# EAGLE design FT231X Breakout (EAGLE 6.4)
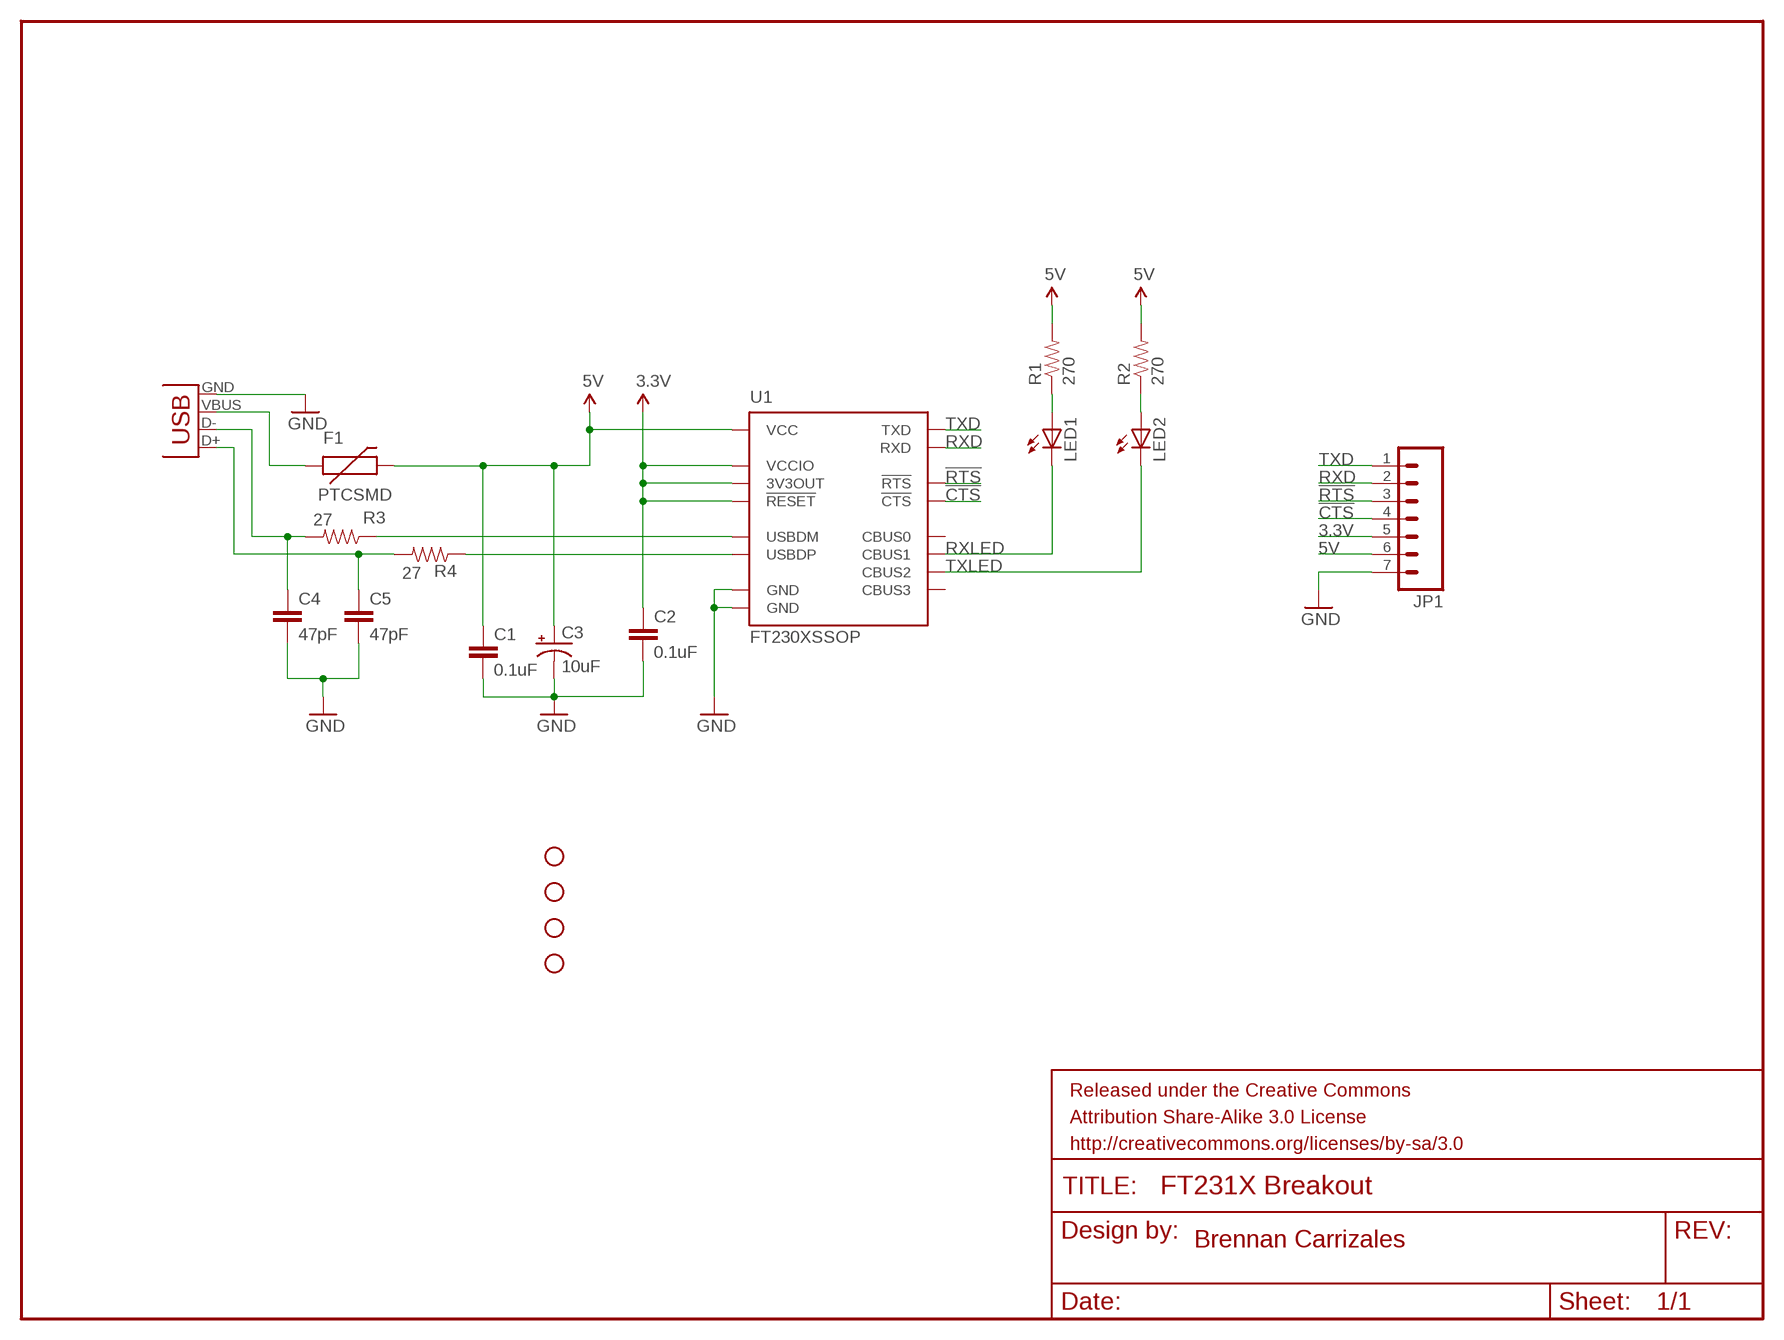
[diagram p0: schematic, sheet 1]

## Parts
C1  0.1uF  CAP0603-CAP  [0603-CAP]
C2  0.1uF  CAP0603-CAP  [0603-CAP]
C3  10uF  CAP_POL1206-KIT  [EIA3216-KIT]
C4  47pF  CAP0603-CAP  [0603-CAP]
C5  47pF  CAP0603-CAP  [0603-CAP]
F1  PTCSMD  [PTC-1206]
FRAME1  FRAME-LETTER  [CREATIVE_COMMONS]
JP1  M07  [1X07]
JP2  USBSMD  [USB-MINIB]
LED1  LED0603  [LED-0603]
LED2  LED0603  [LED-0603]
R1  270  RESISTOR0603-RES  [0603-RES]
R2  270  RESISTOR0603-RES  [0603-RES]
R3  27  RESISTOR0603-RES  [0603-RES]
R4  27  RESISTOR0603-RES  [0603-RES]
STANDOFF1  STAND-OFF  [STAND-OFF]
STANDOFF2  STAND-OFF  [STAND-OFF]
STANDOFF3  STAND-OFF  [STAND-OFF]
STANDOFF4  STAND-OFF  [STAND-OFF]
U1  FT230XSSOP  [SSOP16]

## Nets
3.3V: C2.1 JP1.5 U1.3(VCCIO) U1.10(3V3OUT) U1.11(!RESET)
5V: C1.1 C3.A(+) F1.2 JP1.6 R1.2 R2.2 U1.12(VCC)
!CTS: JP1.4 U1.6(!CTS)
!RTS: JP1.3 U1.2(!RTS)
GND: C1.2 C2.2 C3.C(-) C4.2 C5.2 JP1.7 JP2.GND U1.5(GND) U1.13(GND)
N$1: F1.1 JP2.VBUS
N$2: C4.1 JP2.D- R3.2
N$3: C5.1 JP2.D+ R4.2
N$4: R4.1 U1.8(USBDP)
N$5: R3.1 U1.9(USBDM)
N$7: LED2.A R2.1
N$8: LED1.A R1.1
RXD: JP1.2 U1.4(RXD)
RXLED: LED1.C U1.14(CBUS1)
TXD: JP1.1 U1.1(TXD)
TXLED: LED2.C U1.7(CBUS2)
Unconnected: U1.15(CBUS0) U1.16(CBUS3)

## Notes on the sheet
- Brennan Carrizales

## Library data of the parts
C1 C2 C4 C5 = SparkFun-Passives:CAP: Capacitor Standard 0603 ceramic capacitor, and 0.1" leaded capacitor.
C3 = SparkFun-Passives:CAP_POL: Capacitor Polarized These are standard SMD and PTH capacitors. Normally 10uF, 47uF, and 100uF in electrolytic and tantalum varieties. Always verify the external diameter of the through hole cap, it varies with capacity, voltage, and manufacturer. The EIA devices should be standard.
F1 = SparkFun-PowerIC:PTC: Resettable Fuse PTC Resettable Fuse. Spark Fun Electronics SKU : COM-08357
FRAME1 = SparkFun-Aesthetics:FRAME-LETTER: Schematic Frame Standard 8.5x11 US Letter frame
JP1 = SparkFun-Connectors:M07: Header 7 Standard 7-pin 0.1" header. Use with straight break away headers (SKU : PRT-00116), right angle break away headers (PRT-00553), swiss pins (PRT-00743), machine pins (PRT-00117), and female headers (PRT-00115). NOTES ON THE VARIANTS LOCK and LOCK_LONGPADS... This footprint was designed to help hold the alignment of a through-hole component (i.e. 7-pin header) while soldering it into place. You may notice that each hole has been shifted either up or down by 0.005 of an inch from it's more standard position (which is usually a perfectly straight line). This slight alteration caused the pins (the squares in the middle) to touch the edges of the holes. Because they are alternating, it causes a "brace" to hold the header in place. 0.005 has proven to be the perfect amount of "off-center" position when using our standard breakaway headers. Although looks a little odd when you look at the bare footprint, once you have a header in there, the alteration is very hard to notice. Also, if you push a header all the way into place, it is covered up entirely on the bottom side. This idea of altering the position of holes to aid alignment will be further integrated into the Sparkfun Library for other footprints. It can help hold any component with 3 or more connection pins.
JP2 = SparkFun-Connectors:USB: USB Connectors USB-B-PTH is fully proven SKU : PRT-00139/CONN-08278 USB-miniB is fully proven SKU : PRT-00587 USB-A-PCB is untested. USB-A-H is throughly reviewed, but untested. Spark Fun Electronics SKU : PRT-00437 USB-B-SMT is throughly reviewed, but untested. Needs silkscreen touching up. USB-A-S has not been used/tested USB-MB-H has not been used/tested USB-MICROB has been used. CONN-09505
LED1 LED2 = SparkFun-LED:LED: LEDs Standard schematic elements and footprints for 5mm, 3mm, 1206, and 0603 sized LEDs. 5mm - Spark Fun Electronics SKU : COM-00529 (and others)
R1-R4 = SparkFun-Passives:RESISTOR: Resistor Basic schematic elements and footprints for 0603, 1206, and PTH resistors.
STANDOFF1-STANDOFF4 = SparkFun-Electromechanical:STAND-OFF: #4 Stand Off This is the mechanical footprint for a #4 phillips button head screw. Use the keepout ring to avoid running the screw head into surrounding components. SKU : PRT-00447
U1 = SparkFun-DigitalIC:FT230X: The FT230X is a simple USB to serial converter IC. The CBUS lines can be used as TX and RX activity LEDs, RS485 Tx data enable, and device sleep control.

## Board
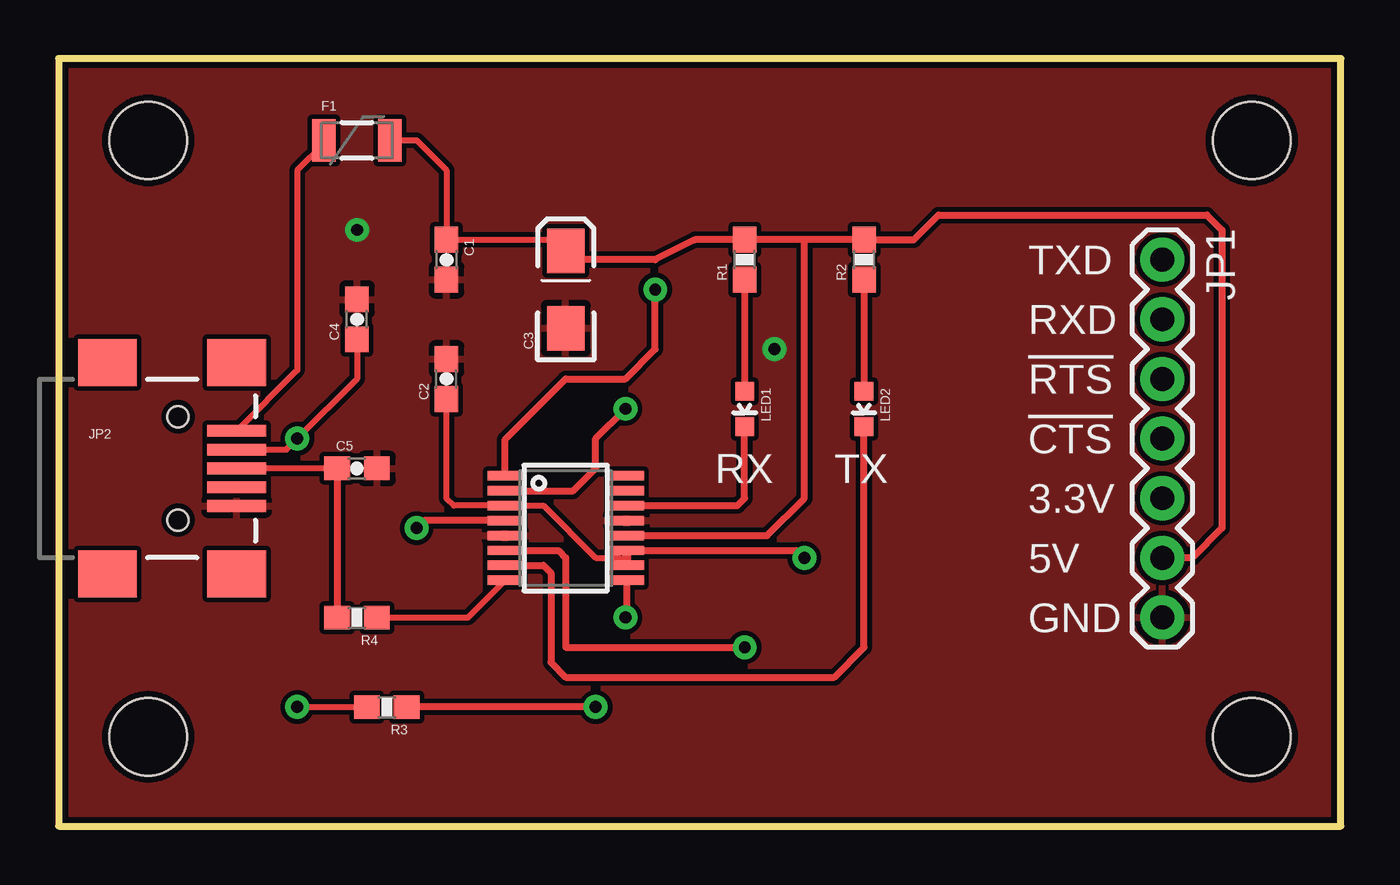
[diagram p1: board, top side]
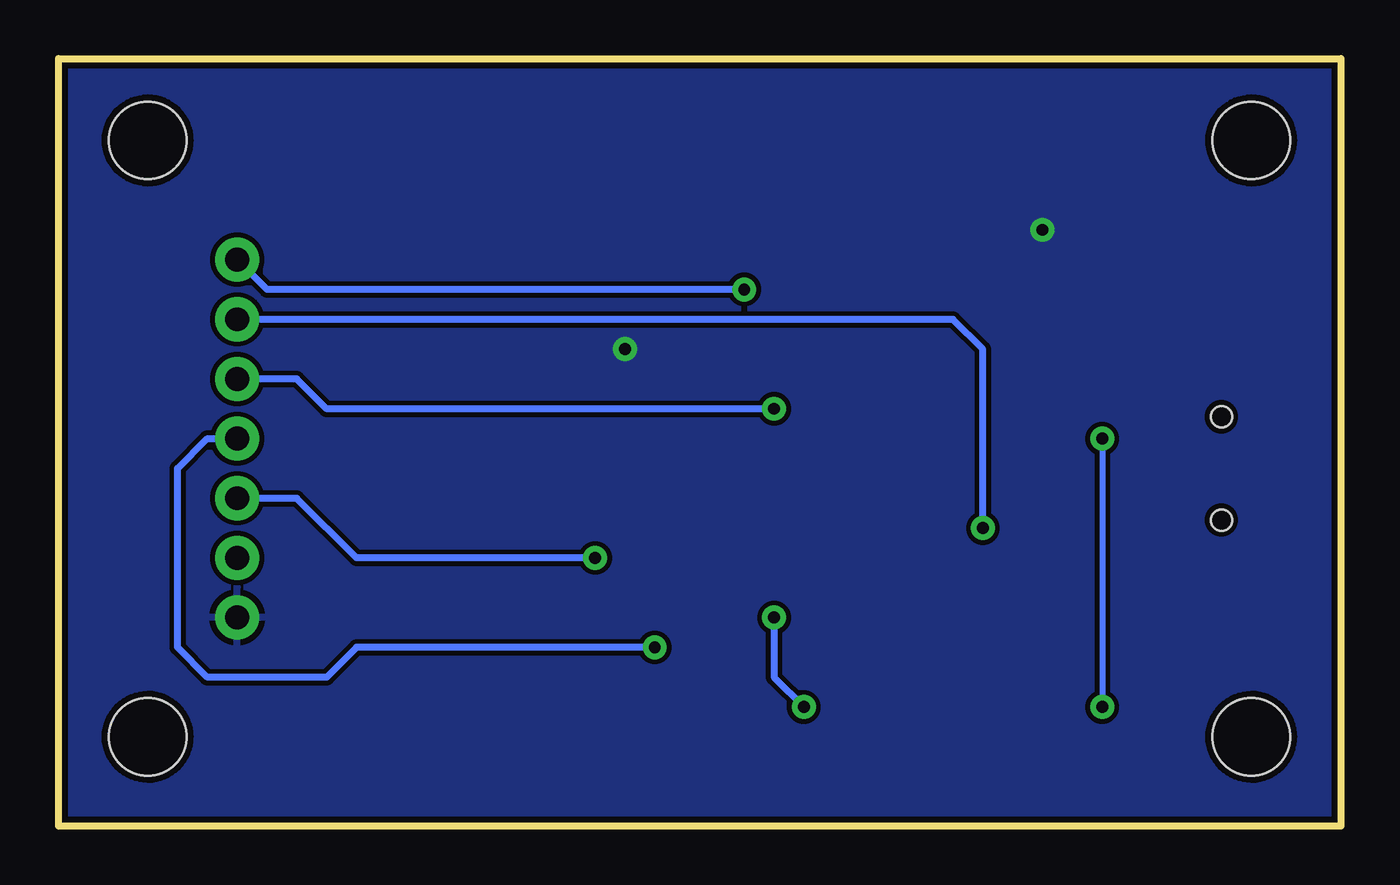
[diagram p2: board, bottom side, seen from below]

Size 54.59 x 32.69 mm. Coordinates in mm from the lower left corner, seen from the top.
Outline: 0,0 54.59,0 54.59,32.69 0,32.69 0,0
Copper layers (1*16): Top 0.035mm / dielectric 1.5mm / Bottom 0.035mm
Design rules "SparkFun": minimum track width 8mil, minimum drill 20mil, track to track 8mil, track to pad 8mil, pad to pad 8mil, via to via 8mil, smd to smd 8mil, copper to edge 10mil, drill to drill 8mil, minimum pad ring 12mil, minimum via ring 10mil, stop-mask expansion 4mil, vias tented up to drill 25mil, thermal gap 10mil

### Footprints (pad centres in the part's own frame; a part is rotated, then mirrored left to right if it is on the bottom)
0603-CAP = smd 1.1 x 1: 1 -0.85,0; 2 0.85,0
EIA3216-KIT = smd 1.9 x 1.6: A 1.65,0; C -1.65,0
PTC-1206 = smd 1 x 1.8: 1 -1.4,0; 2 1.4,0
1X07 = drill 1.016 pad 1.88: 1 0,0; 2 2.54,0; 3 5.08,0; 4 7.62,0; 5 10.16,0; 6 12.7,0; 7 15.24,0
USB-MINIB = smd 2.5 x 0.5: D+ 2.5,0; D- 2.5,0.8; GND 2.5,-1.6; ID 2.5,-0.8; VBUS 2.5,1.6 | smd 2.5 x 2: MTN1 -3,4.5; MTN2 2.5,4.5; MTN3 -3,-4.5; MTN4 2.5,-4.5 | hole 0.9: 0,2.2; 0,-2.2
LED-0603 = smd 0.8 x 0.8: A 0,-0.75; C 0,0.75
0603-RES = smd 1.1 x 1: 1 -0.85,0; 2 0.85,0
STAND-OFF = hole 3.302: 0,0
SSOP16 = smd 0.4 x 1.5: 1 -2.223,-2.578; 2 -1.587,-2.578; 3 -0.953,-2.578; 4 -0.318,-2.578; 5 0.318,-2.578; 6 0.953,-2.578; 7 1.587,-2.578; 8 2.223,-2.578; 9 2.223,2.578; 10 1.587,2.578; 11 0.953,2.578; 12 0.318,2.578; 13 -0.318,2.578; 14 -0.953,2.578; 15 -1.587,2.578; 16 -2.223,2.578

### Placement (x,y rotation side)
C1  16.51,24.13 270 top
C2  16.51,19.05 90 top
C3  21.59,22.86 90 top
C4  12.7,21.59 90 top
C5  12.7,15.24 0 top
F1  12.7,29.21 0 top
FRAME1  5.08,-7.62 0 top  (outside the outline)
JP1  46.99,24.13 270 top
JP2  5.08,15.24 0 top
LED1  29.21,17.78 180 top
LED2  34.29,17.78 180 top
R1  29.21,24.13 90 top
R2  34.29,24.13 90 top
R3  13.97,5.08 180 top
R4  12.7,8.89 180 top
STANDOFF1  50.8,3.81 0 top
STANDOFF2  50.8,29.21 0 top
STANDOFF3  3.81,29.21 0 top
STANDOFF4  3.81,3.81 0 top
U1  21.59,12.7 270 top

### Tracks (layer width: path | path; a pad name or v marks a point on that pad's centre or on a via)
3.3V  (via drill 0.51)
  Top 0.254: C2.1 16.51,13.97 16.83,13.65 U1.3 20.64,13.65 22.86,11.43 23.85,11.43 U1.10
  Top 0.305: U1.11 31.43,11.75 v31.75,11.43
  Top 0.406: U1.11 U1.10
  Bottom 0.305: v31.75,11.43 41.91,11.43 44.45,13.97 JP1.5
5V
  Top 0.254: F1.2 15.24,29.21 16.51,27.94 C1.1 21.12,24.98 C3.A
  Top 0.305: 31.75,24.98 R2.2 36.41,24.98 37.47,26.04 48.9,26.04 49.53,25.4 49.53,12.7 48.26,11.43 JP1.6 | 31.75,24.98 R1.2 27.09,24.98 25.4,24.13 21.97,24.13 C3.A | U1.12 30.16,12.38 31.75,13.97 31.75,24.98
!CTS  (via drill 0.51)
  Top 0.305: U1.6 21.27,11.75 21.59,11.43 21.59,7.62 v29.21,7.62
  Bottom 0.305: v29.21,7.62 41.91,7.62 43.18,6.35 48.26,6.35 49.53,7.62 49.53,15.24 48.26,16.51 JP1.4
!RTS  (via drill 0.51)
  Top 0.305: U1.2 21.91,14.29 22.86,15.24 22.86,16.51 v24.13,17.78
  Bottom 0.305: v24.13,17.78 43.18,17.78 44.45,19.05 JP1.3
GND  (via drill 0.51)
  other vias: 12.7,25.4 30.48,20.32
  pour Top: 0,0 0,33.02 54.61,33.02 54.61,0
  pour Bottom: 0,33.02 0,0 54.61,0 54.61,33.02
N$1
  Top 0.254: F1.1 11.3,29.08 10.16,27.94 10.16,19.42 JP2.VBUS
N$2  (via drill 0.51)
  Top 0.254: JP2.D- 9.69,16.04 v10.16,16.51 12.7,19.05 C4.1 | v10.16,5.08 R3.2
  Bottom 0.254: v10.16,16.51 v10.16,5.08
N$3
  Top 0.254: C5.1 JP2.D+
  Top 0.305: C5.1 R4.2
N$4
  Top 0.254: R4.1 17.42,8.89 U1.8
N$5  (via drill 0.51)
  Top 0.305: U1.9 24.17,8.93 v24.13,8.89 | v22.86,5.08 R3.1
  Bottom 0.305: v24.13,8.89 24.13,6.35 v22.86,5.08
N$7
  Top 0.305: R2.1 LED2.A
N$8
  Top 0.305: R1.1 LED1.A
RXD  (via drill 0.51)
  Top 0.305: U1.4 15.56,13.02 v15.24,12.7
  Bottom 0.305: v15.24,12.7 15.24,20.32 16.51,21.59 JP1.2
RXLED
  Top 0.305: U1.14 28.89,13.65 29.21,13.97 LED1.C
TXD  (via drill 0.51)
  Top 0.305: U1.1 19.01,16.47 21.59,19.05 24.13,19.05 25.4,20.32 v25.4,22.86
  Bottom 0.305: v25.4,22.86 45.72,22.86 JP1.1
TXLED
  Top 0.305: U1.7 20.64,11.11 20.95,10.79 20.95,6.99 21.59,6.35 33.02,6.35 34.29,7.62 LED2.C

### Text on the board
tPlace: TXD | RXD | !RTS | !CTS | RX | TX | 3.3V | 5V | GND